# Altium project 2-SignalLightAndPushbuttonSwitch.PrjPcb
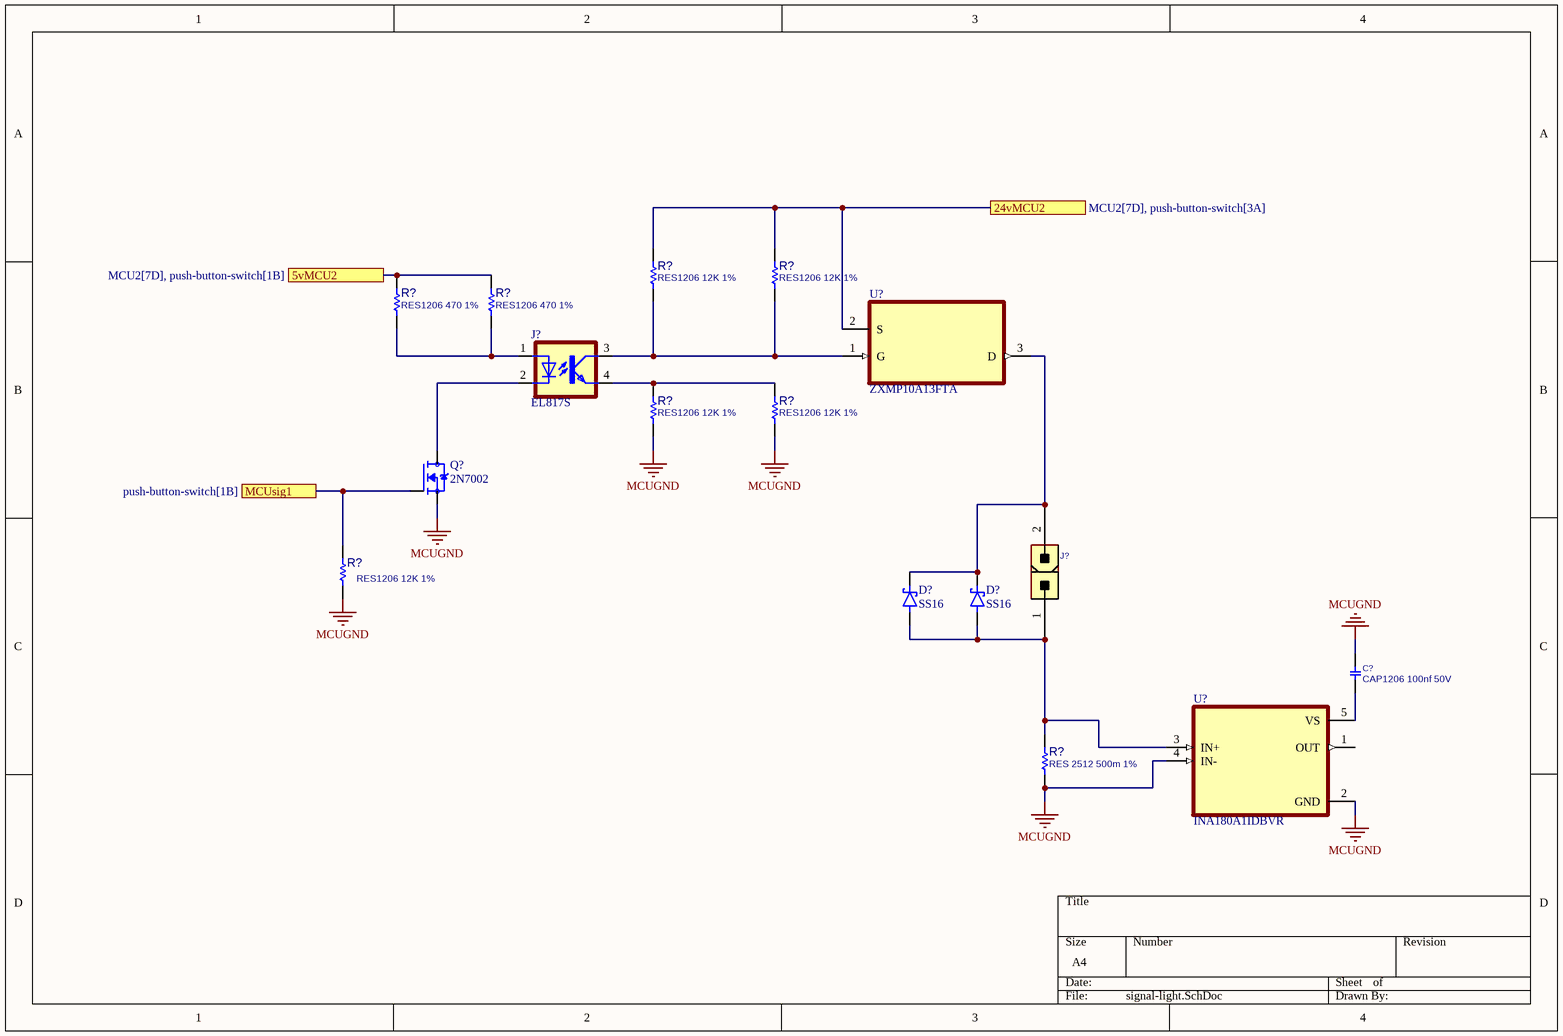
[diagram p0: signal-light.SchDoc]
4 sheets, 71 parts. Net scope: flat (ports and power ports of the same name join across sheets).
Sheets:
  signal-light.SchDoc
  MCU2.SchDoc
  push-button-switch.SchDoc
  RS485.SchDoc

## Sheet signal-light.SchDoc
size A4; SheetNumber: 1; SheetTotal: 3

### Parts
(Parts that share a designator on the sheet are numbered #1, #2 ... from top to bottom, then left to right.)
C?#1  CAP1206 100nf 50V  [C1206]
D?#1  SS16  [DIOM4325X250N]
D?#2  SS16  [DIOM4325X250N]
J?#1  EL817S  [SOIC254P1030X460-4N]
J?#2  CONN_ATXPWR_2  [ATXPWR_2]  (value not drawn)
Q?#1  2N7002  [SOT95P240X111-3N]
R?#1  RES1206 12K 1%  [R1206]
R?#2  RES1206 12K 1%  [R1206]
R?#3  RES1206 470 1%  [R1206]
R?#4  RES1206 470 1%  [R1206]
R?#5  RES1206 12K 1%  [R1206]
R?#6  RES1206 12K 1%  [R1206]
R?#7  RES1206 12K 1%  [R1206]
R?#8  RES 2512 500m 1%  [R2512]
U?#1  ZXMP10A13FTA  [SOT95P230X110-3N]
U?#2  INA180A1IDBVR  [SOT95P280X145-5N]

### Ports
5vMCU2 (see MCU2[7D], push-button-switch[1B]), 24vMCU2 (see MCU2[7D], push-button-switch[3A]), MCUsig1 (see push-button-switch[1B])

### Nets
MCUGND: C?#1.1 Q?#1.2(S) R?#5.2 R?#6.2 R?#7.2 R?#8.1 U?#2.2(GND) U?#2.4(IN-)
5vMCU2: R?#3.2 R?#4.2 ; port 5vMCU2
24vMCU2: R?#1.1 R?#2.1 U?#1.2(S) ; port 24vMCU2
NetC?#1_2: C?#1.2 U?#2.5(VS)
NetD?#1_A: D?#1.A D?#2.A J?#2.1 R?#8.2 U?#2.3(IN+)
NetD?#1_C: D?#1.C(K) D?#2.C(K) J?#2.2 U?#1.3(D)
NetJ?#1_1: J?#1.1(A) R?#3.1 R?#4.1
NetJ?#1_2: J?#1.2(C) Q?#1.3(D)
NetJ?#1_3: J?#1.3(COL) R?#1.2 R?#2.2 U?#1.1(G)
NetJ?#1_4: J?#1.4(EMIT) R?#5.1 R?#6.1
NetQ?#1_1: Q?#1.1(G) R?#7.1 ; port MCUsig1

Not connected (* = marked no-connect by the designer): U?#2 1(OUT)

### Library data of the parts
C?#1 = CAP_SMD_MLCC_1206: CAP, MLCC; PARAM: -, -%; MANF_P#: MANF_PART#; PARAM2: -V; PRICE: 100= 1$; MANF: -; ASSEMBLY: ASSEMBLY
D?#1 D?#2 = SS14: 1A, 40V, Schottky Rectifier; MF: Taiwan Semiconductor; SnapEDA_Link: https://www.snapeda.com/parts/SS14/taiwan/view-part/?ref=snap; Package: SMA-2 Taiwan Semiconductor; Value: *; MP: SS14; Check_prices: https://www.snapeda.com/parts/SS14/taiwan/view-part/?ref=eda
J?#1 = EL817S: Optoisolator Transistor Output 5000Vrms 1 Channel 4-SMD; MF: Everlight Electronics; SnapEDA_Link: https://www.snapeda.com/parts/EL817S/Everlight+Electronics+Co+Ltd/view-part/?ref=snap; Package: SMD-4 Everlight Electronics Co Ltd; Value: *; MP: EL817S; Check_prices: https://www.snapeda.com/parts/EL817S/Everlight+Electronics+Co+Ltd/view-part/?ref=eda
J?#2 = CONN_ATXPWR_2: CONN, ATX POWER, 2 P; MANF: Molex; MANF_P#: 39281023; VALUE: CONN_ATXPWR_2; MountType: THD; PACKAGE: ATXPWR-2pin; Part Type: Conn.
Q?#1 = 2N7002: N-Channel 60V 280mA (Ta) 350mW (Ta) Surface Mount SOT-23-3 (TO-236); MF: {'manufacturer': u'onsemi'}; Package: None; Price: None; Value: *; MP: 2N7002; Availability: Unavailable
R?#1-R?#7 = RES_SMD_1206: RESISTOR, SMD; PARAM: 1%, 0.25W; DESC: DESCRIPTION; DIST#: MOUSER; MANF_P#: -; MANF: -; ASSEMBLY: ASSEMBLY; PRICE: -; PARAM2: -
R?#8 = RES_SMD_2512: RESISTOR, SMD; PARAM: 1%, 1W; DESC: DESCRIPTION; DIST#: MOUSER; MANF_P#: -; MANF: -; ASSEMBLY: ASSEMBLY; PRICE: -; PARAM2: -; VALUE: RES 2512 500m 1%
U?#1 = ZXMP10A13FTA: P-Channel 100 V 600mA (Ta) 625mW (Ta) Surface Mount SOT-23-3; MF: Diodes Inc.; Purchase-URL: https://pricing.snapeda.com/search/part/ZXMP10A13FTA/?ref=eda; Package: SOT-23-3 Diodes Inc.; SnapEDA_Link: https://www.snapeda.com/parts/ZXMP10A13FTA/Diodes+Inc./view-part/?ref=snap; Availability: In Stock; Value: *; MP: ZXMP10A13FTA; Check_prices: https://www.snapeda.com/parts/ZXMP10A13FTA/Diodes+Inc./view-part/?ref=eda; Price: None
U?#2 = INA180A1IDBVR: 26V, 350kHz current sense amplifier; MF: Texas Instruments; SnapEDA_Link: https://www.snapeda.com/parts/INA180A1IDBVR/Texas+Instruments/view-part/?ref=snap; Package: SOT-23-5 Texas Instruments; Value: *; MP: INA180A1IDBVR; Check_prices: https://www.snapeda.com/parts/INA180A1IDBVR/Texas+Instruments/view-part/?ref=eda

## Sheet MCU2.SchDoc
size A3; DocumentNumber: 1; SheetNumber: 2; SheetTotal: 3
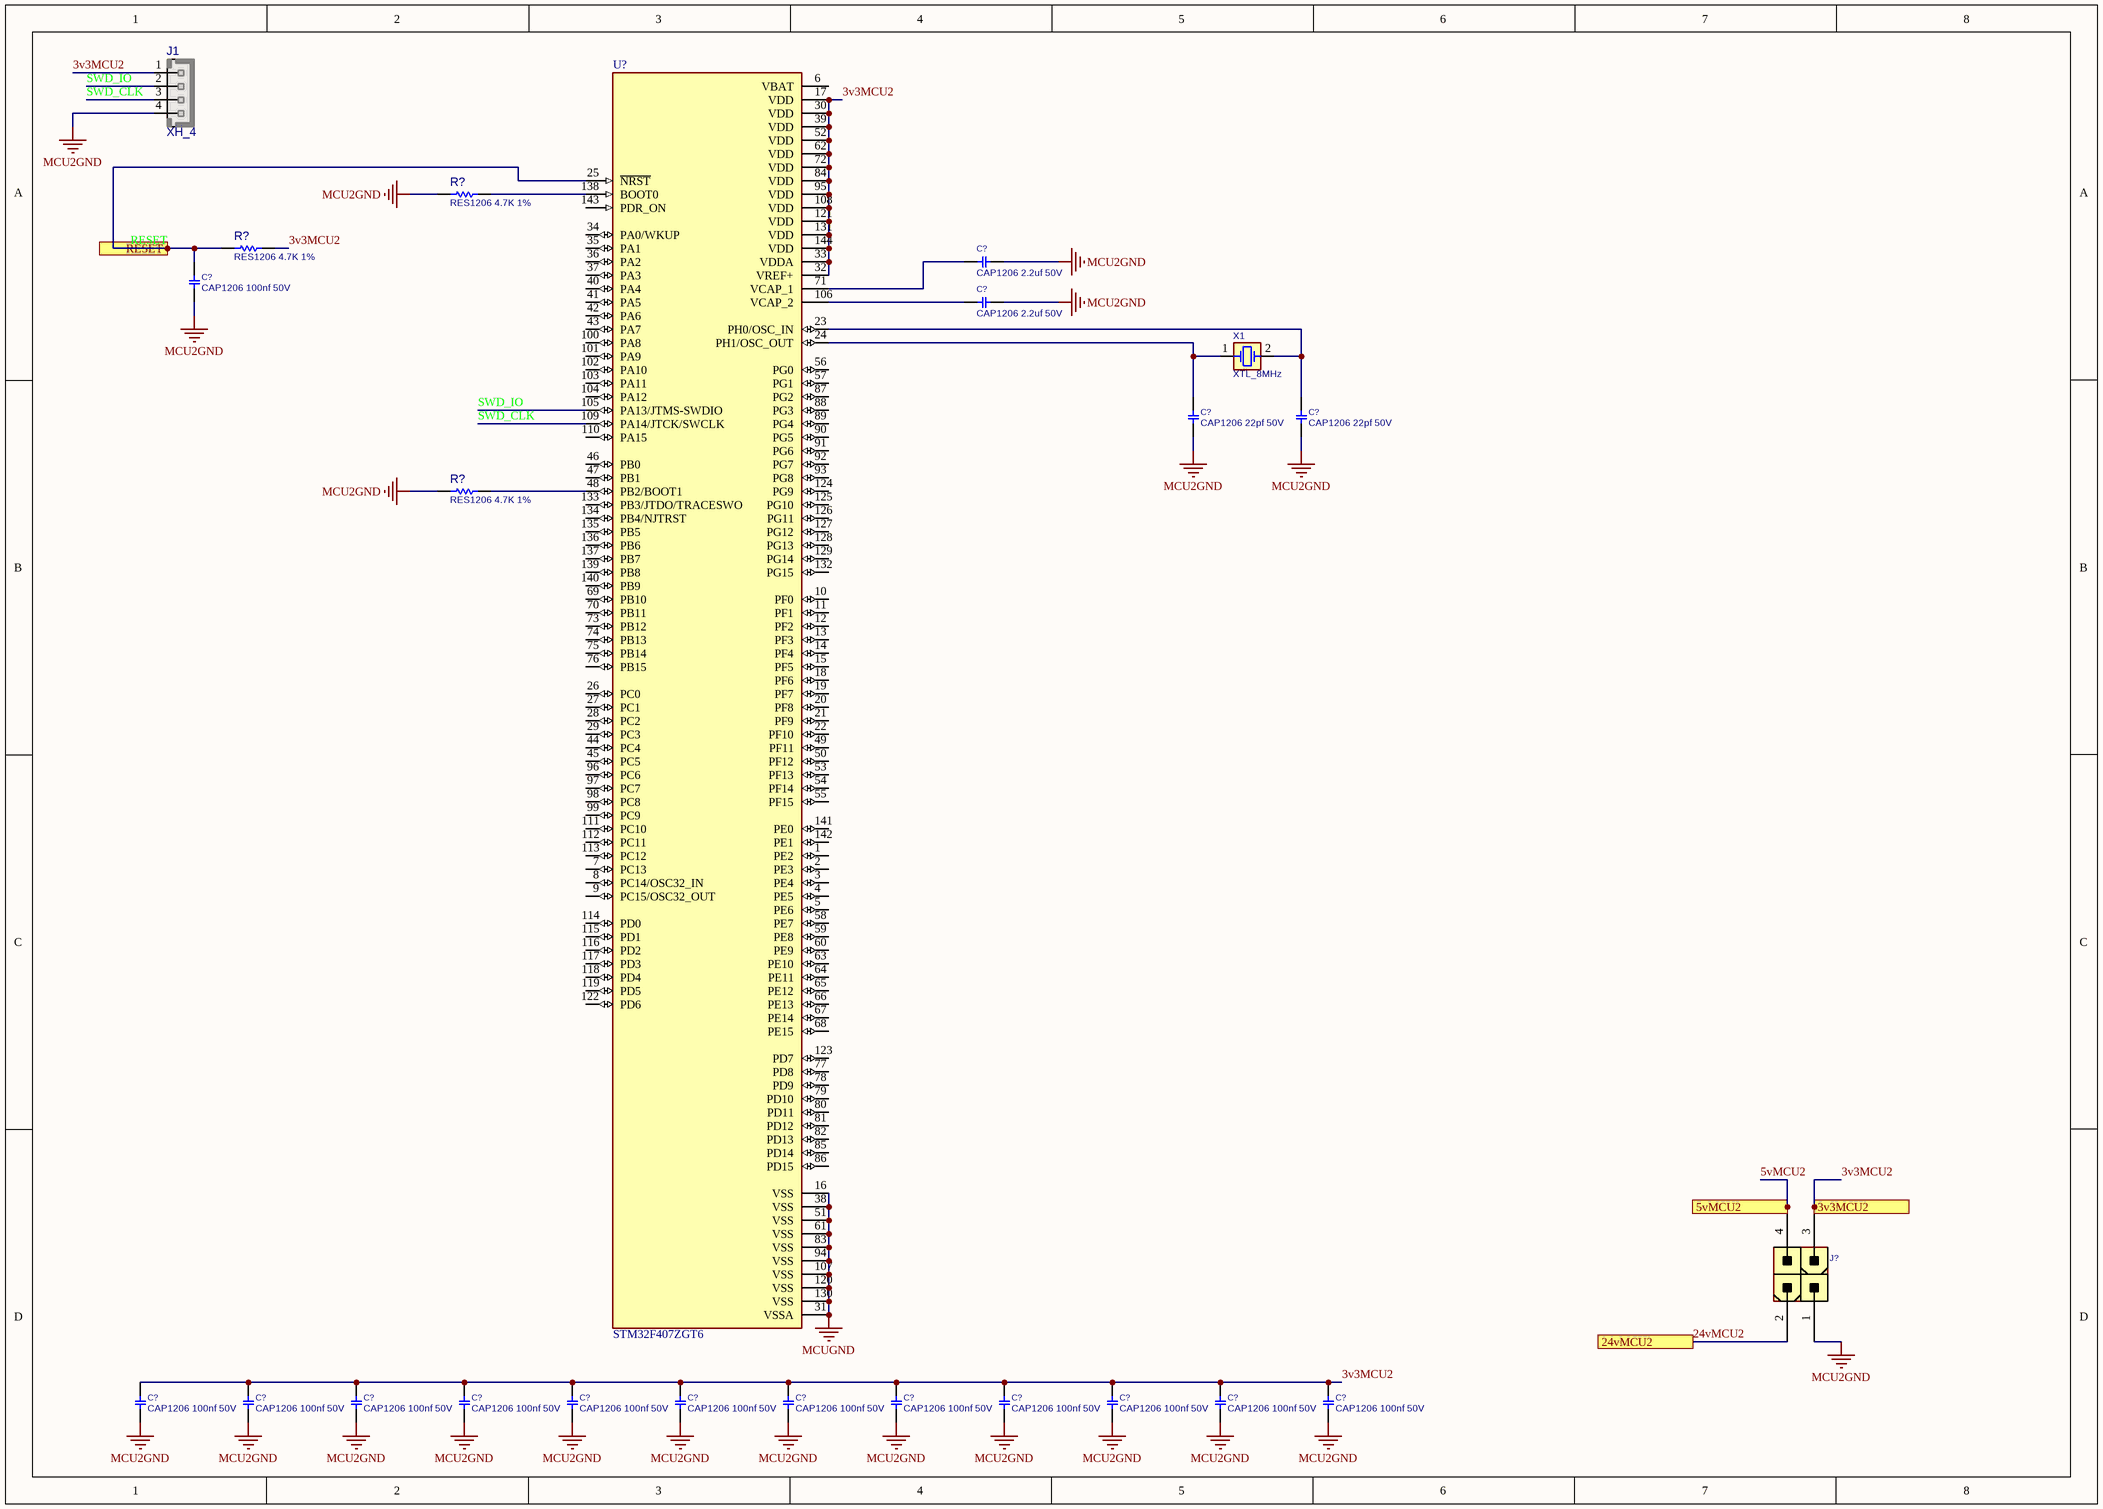
[diagram p1: MCU2.SchDoc]

### Parts
(Parts that share a designator on the sheet are numbered #1, #2 ... from top to bottom, then left to right.)
C?#2  CAP1206 2.2uf 50V  [C1206]
C?#3  CAP1206 100nf 50V  [C1206]
C?#4  CAP1206 2.2uf 50V  [C1206]
C?#5  CAP1206 22pf 50V  [C1206]
C?#6  CAP1206 22pf 50V  [C1206]
C?#7  CAP1206 100nf 50V  [C1206]
C?#8  CAP1206 100nf 50V  [C1206]
C?#9  CAP1206 100nf 50V  [C1206]
C?#10  CAP1206 100nf 50V  [C1206]
C?#11  CAP1206 100nf 50V  [C1206]
C?#12  CAP1206 100nf 50V  [C1206]
C?#13  CAP1206 100nf 50V  [C1206]
C?#14  CAP1206 100nf 50V  [C1206]
C?#15  CAP1206 100nf 50V  [C1206]
C?#16  CAP1206 100nf 50V  [C1206]
C?#17  CAP1206 100nf 50V  [C1206]
C?#18  CAP1206 100nf 50V  [C1206]
J1  XH_4  [XH_4]
J?#3  CONN_ATXPWR_4  [ATXPWR_4]  (value not drawn)
R?#9  RES1206 4.7K 1%  [R1206]
R?#10  RES1206 4.7K 1%  [R1206]
R?#11  RES1206 4.7K 1%  [R1206]
U?#3  STM32F407ZGT6  [QFP50P2200X2200X160-144N]
X1  XTL_8MHz  [XTL_2_11X5]

### Ports
3v3MCU2, 5vMCU2, 24vMCU2, RESET

### Nets
MCU2GND: C?#2.1 C?#3.1 C?#4.1 C?#5.1 C?#6.1 C?#7.1 C?#8.1 C?#9.1 C?#10.1 C?#11.1 C?#12.1 C?#13.1 C?#14.1 C?#15.1 C?#16.1 C?#17.1 C?#18.1 J1.4 J?#3.1 R?#9.2 R?#11.2
MCUGND: U?#3.16(VSS) U?#3.31(VSSA) U?#3.38(VSS) U?#3.51(VSS) U?#3.61(VSS) U?#3.83(VSS) U?#3.94(VSS) U?#3.107(VSS) U?#3.120(VSS) U?#3.130(VSS)
3v3MCU2: C?#7.2 C?#8.2 C?#9.2 C?#10.2 C?#11.2 C?#12.2 C?#13.2 C?#14.2 C?#15.2 C?#16.2 C?#17.2 C?#18.2 J1.1 J?#3.3 R?#10.2 U?#3.17(VDD) U?#3.30(VDD) U?#3.32(VREF+) U?#3.33(VDDA) U?#3.39(VDD) U?#3.52(VDD) U?#3.62(VDD) U?#3.72(VDD) U?#3.84(VDD) U?#3.95(VDD) U?#3.108(VDD) U?#3.121(VDD) U?#3.131(VDD) U?#3.144(VDD) ; port 3v3MCU2
5vMCU2: J?#3.4 ; port 5vMCU2
24vMCU2: J?#3.2 ; port 24vMCU2
RESET: C?#3.2 R?#10.1 U?#3.25(~{NRST}) ; port RESET
SWD_CLK: J1.3 U?#3.109(PA14/JTCK/SWCLK)
SWD_IO: J1.2 U?#3.105(PA13/JTMS-SWDIO)
NetC?#2_2: C?#2.2 U?#3.71(VCAP_1)
NetC?#4_2: C?#4.2 U?#3.106(VCAP_2)
NetC?#5_2: C?#5.2 U?#3.24(PH1/OSC_OUT) X1.1(OSC1)
NetC?#6_2: C?#6.2 U?#3.23(PH0/OSC_IN) X1.2(OSC2)
NetR?#9_1: R?#9.1 U?#3.138(BOOT0)
NetR?#11_1: R?#11.1 U?#3.48(PB2/BOOT1)

Not connected (* = marked no-connect by the designer): U?#3 1(PE2) 2(PE3) 3(PE4) 4(PE5) 5(PE6) 6(VBAT) 7(PC13) 8(PC14/OSC32_IN) 9(PC15/OSC32_OUT) 10(PF0) 11(PF1) 12(PF2) 13(PF3) 14(PF4) 15(PF5) 18(PF6) 19(PF7) 20(PF8) 21(PF9) 22(PF10) 26(PC0) 27(PC1) 28(PC2) 29(PC3) 34(PA0/WKUP) 35(PA1) 36(PA2) 37(PA3) 40(PA4) 41(PA5) 42(PA6) 43(PA7) 44(PC4) 45(PC5) 46(PB0) 47(PB1) 49(PF11) 50(PF12) 53(PF13) 54(PF14) 55(PF15) 56(PG0) 57(PG1) 58(PE7) 59(PE8) 60(PE9) 63(PE10) 64(PE11) 65(PE12) 66(PE13) 67(PE14) 68(PE15) 69(PB10) 70(PB11) 73(PB12) 74(PB13) 75(PB14) 76(PB15) 77(PD8) 78(PD9) 79(PD10) 80(PD11) 81(PD12) 82(PD13) 85(PD14) 86(PD15) 87(PG2) 88(PG3) 89(PG4) 90(PG5) 91(PG6) 92(PG7) 93(PG8) 96(PC6) 97(PC7) 98(PC8) 99(PC9) 100(PA8) 101(PA9) 102(PA10) 103(PA11) 104(PA12) 110(PA15) 111(PC10) 112(PC11) 113(PC12) 114(PD0) 115(PD1) 116(PD2) 117(PD3) 118(PD4) 119(PD5) 122(PD6) 123(PD7) 124(PG9) 125(PG10) 126(PG11) 127(PG12) 128(PG13) 129(PG14) 132(PG15) 133(PB3/JTDO/TRACESWO) 134(PB4/NJTRST) 135(PB5) 136(PB6) 137(PB7) 139(PB8) 140(PB9) 141(PE0) 142(PE1) 143(PDR_ON)

### Library data of the parts
C?#2-C?#18 = CAP_SMD_MLCC_1206: as C?#1 on sheet signal-light; PRICE: 100= 1$; MANF: -; ASSEMBLY: ASSEMBLY
J1 = XH_4: PW10-x-M, JST-BxB-XH-A pitch: 2.5mm, 3A/250v; MANF: JST; MANF_P#: B4B-XH-A; PARAM2: 250v; PARAM: 3.0A; VALUE: XH_4
J?#3 = CONN_ATXPWR_4: CONN, ATX POWER, 4 P; MANF: TE, Molex; MANF_P#: 4-1775099-0, 39281043; VALUE: CONN_ATXPWR_4; MountType: THD; PACKAGE: ATXPWR-4pin; Part Type: Conn.
R?#9-R?#11 = RES_SMD_1206: as R?#1 on sheet signal-light; MANF_P#: -; MANF: -; ASSEMBLY: ASSEMBLY; PRICE: -; PARAM2: -
U?#3 = STM32F407ZGT6: ARMÂ® CortexÂ®-M4 STM32F4 Microcontroller IC 32-Bit Single-Core 168MHz 1MB (1M x 8) FLASH 144-LQFP (20x20); MF: STMicroelectronics; SnapEDA_Link: https://www.snapeda.com/parts/STM32F407ZGT6/STMicroelectronics/view-part/?ref=snap; Package: LQFP-144 STMicroelectronics; Value: *; MP: STM32F407ZGT6; Check_prices: https://www.snapeda.com/parts/STM32F407ZGT6/STMicroelectronics/view-part/?ref=eda
X1 = XTL_2_HC49_8MHz_SMD: Crystal MOST POPULAR ABL HC49 PACKAGE; MANF: ABRACON; MANF_P#: ABLS-8.000MHZ-B4-T; PARAM: 8MHz, 18pF, 30PPM, -20~70oC; PRICE: 0.3$; VALUE: XTL_8MHz

## Sheet push-button-switch.SchDoc
size A4; SheetNumber: 3; SheetTotal: 3
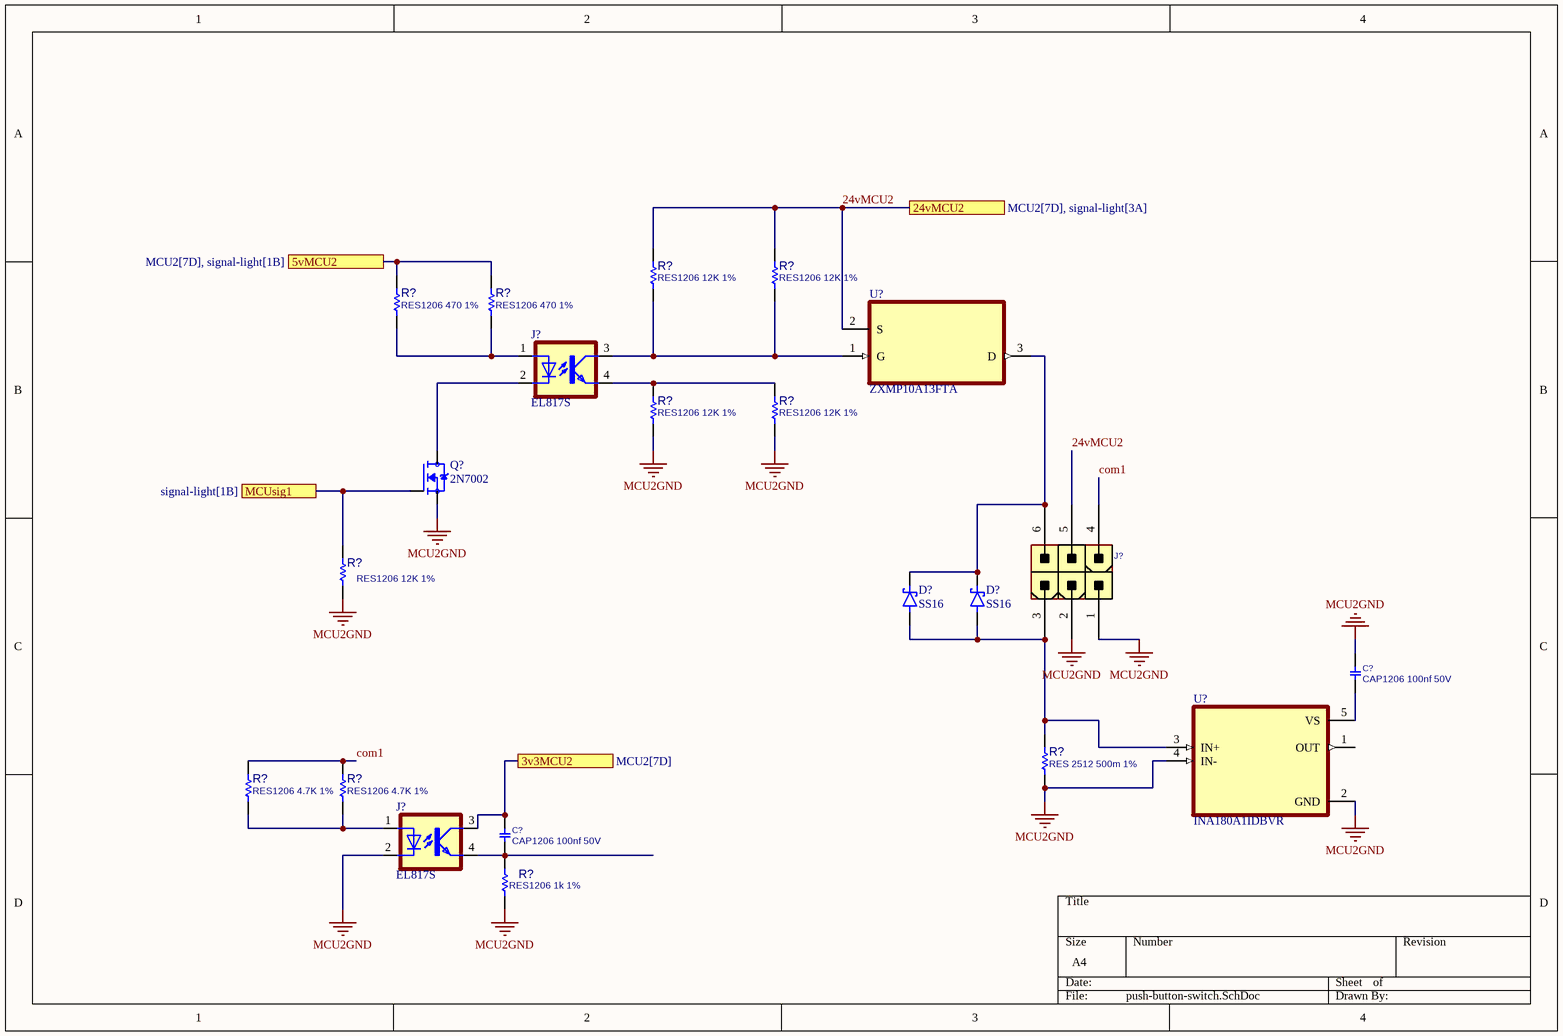
[diagram p2: push-button-switch.SchDoc]

### Parts
(Parts that share a designator on the sheet are numbered #1, #2 ... from top to bottom, then left to right.)
C?#19  CAP1206 100nf 50V  [C1206]
C?#20  CAP1206 100nf 50V  [C1206]
D?#3  SS16  [DIOM4325X250N]
D?#4  SS16  [DIOM4325X250N]
J?#4  EL817S  [SOIC254P1030X460-4N]
J?#5  CONN_ATXPWR_6  [ATXPWR_6]  (value not drawn)
J?#6  EL817S  [SOIC254P1030X460-4N]
Q?#2  2N7002  [SOT95P240X111-3N]
R?#12  RES1206 12K 1%  [R1206]
R?#13  RES1206 12K 1%  [R1206]
R?#14  RES1206 470 1%  [R1206]
R?#15  RES1206 470 1%  [R1206]
R?#16  RES1206 12K 1%  [R1206]
R?#17  RES1206 12K 1%  [R1206]
R?#18  RES1206 12K 1%  [R1206]
R?#19  RES 2512 500m 1%  [R2512]
R?#20  RES1206 4.7K 1%  [R1206]
R?#21  RES1206 4.7K 1%  [R1206]
R?#22  RES1206 1k 1%  [R1206]
U?#4  ZXMP10A13FTA  [SOT95P230X110-3N]
U?#5  INA180A1IDBVR  [SOT95P280X145-5N]

### Ports
3v3MCU2 (see MCU2[7D]), 5vMCU2 (see MCU2[7D], signal-light[1B]), 24vMCU2 (see MCU2[7D], signal-light[3A]), MCUsig1 (see signal-light[1B])

### Nets
MCU2GND: C?#19.1 J?#5.1 J?#5.2 J?#6.2(C) Q?#2.2(S) R?#16.2 R?#17.2 R?#18.2 R?#19.1 R?#22.1 U?#5.2(GND) U?#5.4(IN-)
3v3MCU2: C?#20.1 J?#6.3(COL) ; port 3v3MCU2
5vMCU2: R?#14.2 R?#15.2 ; port 5vMCU2
24vMCU2: J?#5.5 R?#12.1 R?#13.1 U?#4.2(S) ; port 24vMCU2
com1: J?#5.4 R?#20.2 R?#21.2
NetC?#19_2: C?#19.2 U?#5.5(VS)
NetC?#20_2: C?#20.2 J?#6.4(EMIT) R?#22.2
NetD?#3_A: D?#3.A D?#4.A J?#5.3 R?#19.2 U?#5.3(IN+)
NetD?#3_C: D?#3.C(K) D?#4.C(K) J?#5.6 U?#4.3(D)
NetJ?#4_1: J?#4.1(A) R?#14.1 R?#15.1
NetJ?#4_2: J?#4.2(C) Q?#2.3(D)
NetJ?#4_3: J?#4.3(COL) R?#12.2 R?#13.2 U?#4.1(G)
NetJ?#4_4: J?#4.4(EMIT) R?#16.1 R?#17.1
NetJ?#6_1: J?#6.1(A) R?#20.1 R?#21.1
NetQ?#1_1: Q?#2.1(G) R?#18.1 ; port MCUsig1

Not connected (* = marked no-connect by the designer): U?#5 1(OUT)

### Library data of the parts
C?#19 C?#20 = CAP_SMD_MLCC_1206: as C?#1 on sheet signal-light; PRICE: 100= 1$; MANF: -; ASSEMBLY: ASSEMBLY
D?#3 D?#4 = SS14: as D?#1 on sheet signal-light; SnapEDA_Link: https://www.snapeda.com/parts/SS14/taiwan/view-part/?ref=snap; Package: SMA-2 Taiwan Semiconductor; Value: *; MP: SS14; Check_prices: https://www.snapeda.com/parts/SS14/taiwan/view-part/?ref=eda
J?#4 J?#6 = EL817S: as J?#1 on sheet signal-light; SnapEDA_Link: https://www.snapeda.com/parts/EL817S/Everlight+Electronics+Co+Ltd/view-part/?ref=snap; Package: SMD-4 Everlight Electronics Co Ltd; Value: *; MP: EL817S; Check_prices: https://www.snapeda.com/parts/EL817S/Everlight+Electronics+Co+Ltd/view-part/?ref=eda
J?#5 = CONN_ATXPWR_6: CONN, ATX POWER, 6 P; MANF: TE; MANF_P#: 4-1775099-1; VALUE: CONN_ATXPWR_6; MountType: THD; PACKAGE: ATXPWR-6pin; Part Type: Conn.
Q?#2 = 2N7002: as Q?#1 on sheet signal-light; Package: None; Price: None; Value: *; MP: 2N7002; Availability: Unavailable
R?#12-R?#18 R?#20-R?#22 = RES_SMD_1206: as R?#1 on sheet signal-light; MANF_P#: -; MANF: -; ASSEMBLY: ASSEMBLY; PRICE: -; PARAM2: -
R?#19 = RES_SMD_2512: as R?#8 on sheet signal-light; MANF_P#: -; MANF: -; ASSEMBLY: ASSEMBLY; PRICE: -; PARAM2: -; VALUE: RES 2512 500m 1%
U?#4 = ZXMP10A13FTA: as U?#1 on sheet signal-light; Purchase-URL: https://pricing.snapeda.com/search/part/ZXMP10A13FTA/?ref=eda; Package: SOT-23-3 Diodes Inc.; SnapEDA_Link: https://www.snapeda.com/parts/ZXMP10A13FTA/Diodes+Inc./view-part/?ref=snap; Availability: In Stock; Value: *; MP: ZXMP10A13FTA; Check_prices: https://www.snapeda.com/parts/ZXMP10A13FTA/Diodes+Inc./view-part/?ref=eda; Price: None
U?#5 = INA180A1IDBVR: as U?#2 on sheet signal-light; SnapEDA_Link: https://www.snapeda.com/parts/INA180A1IDBVR/Texas+Instruments/view-part/?ref=snap; Package: SOT-23-5 Texas Instruments; Value: *; MP: INA180A1IDBVR; Check_prices: https://www.snapeda.com/parts/INA180A1IDBVR/Texas+Instruments/view-part/?ref=eda

## Sheet RS485.SchDoc
size A4; SheetNumber: 4; SheetTotal: 4
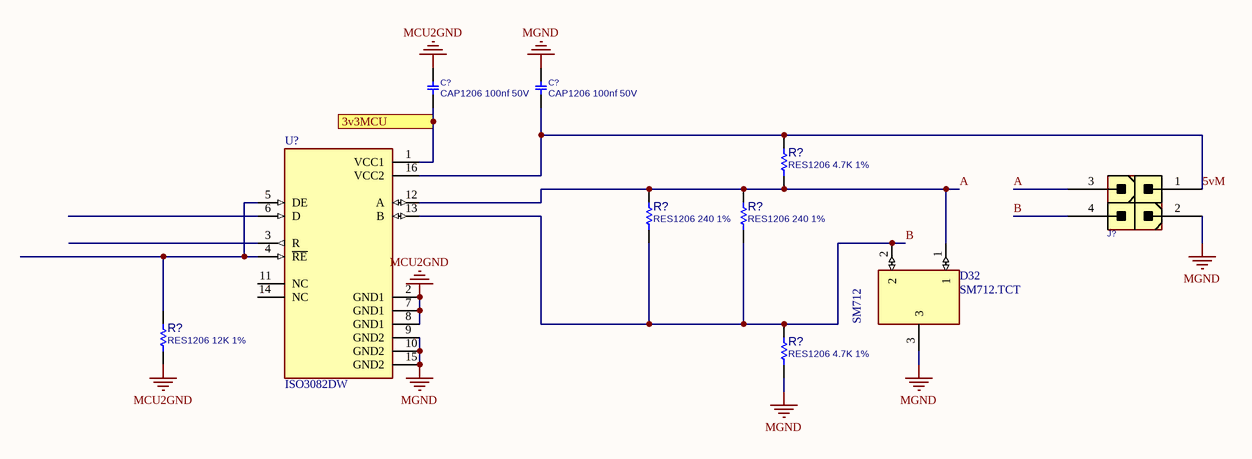
[diagram p3: RS485.SchDoc]

### Parts
(Parts that share a designator on the sheet are numbered #1, #2 ... from top to bottom, then left to right.)
C?#21  CAP1206 100nf 50V  [C1206]
C?#22  CAP1206 100nf 50V  [C1206]
D32  SM712.TCT  [SOT23]
J?#7  CONN_ATXPWR_4  [ATXPWR_4]  (value not drawn)
R?#23  RES1206 4.7K 1%  [R1206]
R?#24  RES1206 240 1%  [R1206]
R?#25  RES1206 240 1%  [R1206]
R?#26  RES1206 12K 1%  [R1206]
R?#27  RES1206 4.7K 1%  [R1206]
U?#6  ISO3082DW  [SOIC127P1030X265-16N]

### Ports
3v3MCU

### Nets
MCU2GND: C?#21.1 R?#26.1 U?#6.2(GND1) U?#6.7(GND1) U?#6.8(GND1)
MGND: C?#22.1 D32.3 J?#7.2 R?#27.1 U?#6.9(GND2) U?#6.10(GND2) U?#6.15(GND2)
5vM: C?#22.2 J?#7.1 R?#23.2 U?#6.16(VCC2)
A: D32.1 J?#7.3 R?#23.1 R?#24.2 R?#25.2 U?#6.12(A)
B: D32.2 J?#7.4 R?#24.1 R?#25.1 R?#27.2 U?#6.13(B)
NetC?#21_2: C?#21.2 U?#6.1(VCC1) ; port 3v3MCU
NetR?#26_2: R?#26.2 U?#6.4(~{RE}) U?#6.5(DE)

Not connected (* = marked no-connect by the designer): U?#6 3(R) 6(D) 11(NC) 14(NC)

### Notes on the sheet
- (in symbol SM712.TCT) SM712

### Library data of the parts
C?#21 C?#22 = CAP_SMD_MLCC_1206: as C?#1 on sheet signal-light; PRICE: 100= 1$; MANF: -; ASSEMBLY: ASSEMBLY
D32 = SM712.TCT: SM Series 12 V 400 W Asymmetrical TVS Diode for Extended Common-Mode - SOT-23; MF: Semtech Corporation; SnapEDA_Link: https://www.snapeda.com/parts/SM712.TCT/Semtech/view-part/?ref=snap; Package: SOT-23 Semtech; Value: *; MP: SM712.TCT; Check_prices: https://www.snapeda.com/parts/SM712.TCT/Semtech/view-part/?ref=eda
J?#7 = CONN_ATXPWR_4: as J?#3 on sheet MCU2; VALUE: CONN_ATXPWR_4; MountType: THD; PACKAGE: ATXPWR-4pin; Part Type: Conn.
R?#23-R?#27 = RES_SMD_1206: as R?#1 on sheet signal-light; MANF_P#: -; MANF: -; ASSEMBLY: ASSEMBLY; PRICE: -; PARAM2: -
U?#6 = ISO3082DW: 200-Kbps, half-duplex, 2.5-kVrms isolated RS-485 & RS-422 transceiver; MF: Texas Instruments; SnapEDA_Link: https://www.snapeda.com/parts/ISO3082DW/Texas+Instruments/view-part/?ref=snap; Package: SOIC-16 Texas Instruments; Value: *; MP: ISO3082DW; Check_prices: https://www.snapeda.com/parts/ISO3082DW/Texas+Instruments/view-part/?ref=eda

## Nets that join several sheets
MCU2GND: MCU2 (21 pins), push-button-switch (12 pins), RS485 (5 pins)
MCUGND: signal-light (8 pins), MCU2 (10 pins)
3v3MCU2: MCU2 (29 pins), push-button-switch (C?#20.1 J?#6.3)
5vMCU2: signal-light (R?#3.2 R?#4.2), MCU2 (J?#3.4), push-button-switch (R?#14.2 R?#15.2)
24vMCU2: signal-light (R?#1.1 R?#2.1 U?#1.2), MCU2 (J?#3.2), push-button-switch (J?#5.5 R?#12.1 R?#13.1 U?#4.2)
NetQ?#1_1: signal-light (Q?#1.1 R?#7.1), push-button-switch (Q?#2.1 R?#18.1)